# Altium schematic sheet 28pins_Antariksh_unoR3_V1I1_Schematic.SchDoc (part 3 of 5)
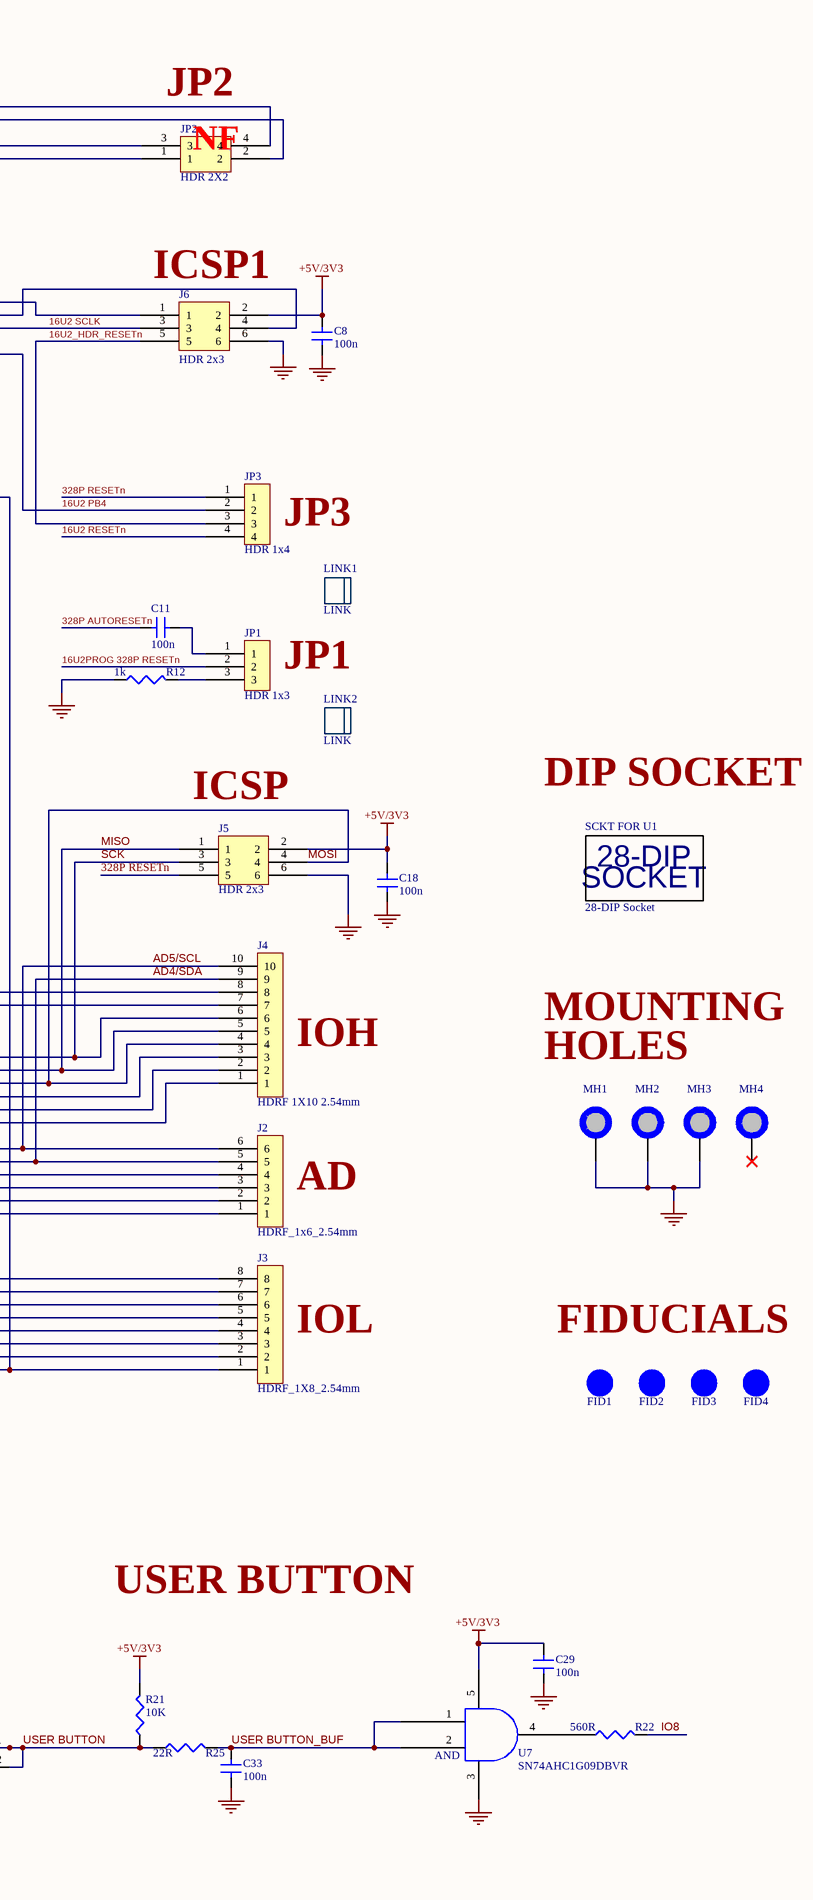
[diagram p3: 28pins_Antariksh_unoR3_V1I1_Schematic.SchDoc, right]

## Library data of the parts (continued)
J5 J6 = 67997-106HLF: Conn; Rect; Header; Unshrouded; 6 Pos; 2.54mm Pitch; 2-Row; Thru-Hole; BergStik; Manufacturer: Amphenol Communications Solutions; Connector Type: Male Pin; Current Rating: 5A; Dielectric Material: Polyethylene; Gender: Male; Insulation Resistance: 5GΩ; Lead Length: 3.05mm; Mating Post Length: 5.84mm; Max Voltage Rating (AC): 1.5kV; Number of Contacts: 6; Supplier 1: RS (Formerly Allied Electronics); Manufacturer Part Number: 67997-106HLF; RoHS: Compliant; Category: Headers and Wire Housings; Stock 1: 800; Pricing 1: 1=0.194 (USD); China RoHS: Compliant; Color: Black; Contact Gender: Male; Contact Material: Bronze; Contact Mating Length: 5.842mm; Contact Plating: Gold; Depth: 4.83mm; Flammability Rating: UL94 V-0; Housing Color: Black; Housing Material: Thermoplastic; Lead Free: Lead Free; Lead Pitch: 2.54mm; Length: 7.62mm; Lifecycle Status: Production; Max Operating Temperature: 130°C; Min Operating Temperature: -65°C; Mount: Through Hole; Number of Pins: 6; Number of Positions: 6; Number of Rows: 2; Orientation: Straight; Pitch: 2.54mm; Radiation Hardening: No; REACH SVHC: Yes; Row Spacing: 2.54mm; Schedule B: 8535908040, 8535908040|8535908040|8535908040|8535908040|8535908040|8535908040|8535908040|8535908040|8535908040|8535908040|8535908040|8535908040|8535908040|8535908040|8535908040|8535908040|8535908040|8535908040|8535908040|8535908040|8535908040|8535908040|8535908040|85; Terminal Pitch: 2.54mm; Termination: Through Hole; Voltage Rating: 1.5kV; ComponentLink1URL: https://datasheet.octopart.com:443/67997-106HLF-Amphenol-Communications-Solutions-datasheet-10288749.pdf?src-supplier=Newark; ComponentLink1Description: https://datasheet.octopart.com:443/67997-106HLF-Amphenol-Communications-Solutions-datasheet-10288749.pdf?src-supplier=Newark; ComponentLink2URL: https://datasheet.octopart.com:443/67997-106HLF-Areva-datasheet-10052131.pdf?src-supplier=Newark; ComponentLink2Description: https://datasheet.octopart.com:443/67997-106HLF-Areva-datasheet-10052131.pdf?src-supplier=Newark; ComponentLink3URL: https://datasheet.octopart.com:443/67997-106HLF-Areva-datasheet-8877144.pdf?src-supplier=Newark; ComponentLink3Description: https://datasheet.octopart.com:443/67997-106HLF-Areva-datasheet-8877144.pdf?src-supplier=Newark; ComponentLink4URL: https://datasheet.octopart.com:443/67997-106HLF-Areva-datasheet-8731571.pdf?src-supplier=Newark; ComponentLink4Description: https://datasheet.octopart.com:443/67997-106HLF-Areva-datasheet-8731571.pdf?src-supplier=Newark; ComponentLink5URL: https://datasheet.octopart.com:443/67997-106HLF-Areva-datasheet-8486089.pdf?src-supplier=Newark; ComponentLink5Description: https://datasheet.octopart.com:443/67997-106HLF-Areva-datasheet-8486089.pdf?src-supplier=Newark; ComponentLink6URL: https://datasheet.octopart.com:443/67997-106HLF-Amphenol-Communications-Solutions-datasheet-36854132.pdf?src-supplier=Farnell; ComponentLink6Description: https://datasheet.octopart.com:443/67997-106HLF-Amphenol-Communications-Solutions-datasheet-36854132.pdf?src-supplier=Farnell; ComponentLink7URL: https://datasheet.octopart.com:443/67997-106HLF-Amphenol-Communications-Solutions-datasheet-20739478.pdf?src-supplier=RS+(Formerly+Allied+Electronics); ComponentLink7Description: https://datasheet.octopart.com:443/67997-106HLF-Amphenol-Communications-Solutions-datasheet-20739478.pdf?src-supplier=RS+(Formerly+Allied+Electronics); ComponentLink8URL: https://datasheet.octopart.com:443/67997-106HLF-Areva-datasheet-118652.pdf?src-supplier=DigiKey; ComponentLink8Description: https://datasheet.octopart.com:443/67997-106HLF-Areva-datasheet-118652.pdf?src-supplier=DigiKey; Supplier Part Number 1: 70302482
J7 = 10118193-0001LF: USB - micro B USB 2.0 Receptacle Connector 5 Position Surface Mount, Right Angle, Horizontal; Manufacturer: Amphenol Communications Solutions; Connector Type: Receptacle, USB; Contact Resistance: 30mΩ; Current Rating: 1.8A; Dielectric Material: Liquid Crystal Polymer; Insulation Resistance: 1GΩ; Max Voltage Rating (AC): 100V; Number of Contacts: 5; Number of Ports: 1; Operating Force: 35.1392N; Pitch: 650µm; Plating Thickness: 762nm; USB Standard: USB 2.0; Supplier 1: Avnet; Manufacturer Part Number: 10118193-0001LF; RoHS: Compliant; Category: USB Connectors; Stock 1: 52800; Pricing 1: 1200=0.21529, 2400=0.20365, 4800=0.19829, 7200=0.19321, 9600=0.18838 (USD); China RoHS: Compliant; Color: Black; Contact Gender: Female; Contact Material: Gold, Nickel; Contact Plating: Gold; Depth: 5.67mm; Features: Shielded; Flammability Rating: UL94 V-0; Height: 3mm; Housing Material: Polymer; Length: 7.86mm; Lifecycle Status: Production; Max Operating Temperature: 80°C; Min Operating Temperature: -55°C; Mount: Horizontal, Surface Mount; Number of Pins: 5; Number of Rows: 1; Number of Terminals: 5; Orientation: Right Angle; Radiation Hardening: No; REACH SVHC: Yes; Shell Material: Stainless Steel; Terminal Pitch: 660.4µm; Termination: Solder; Voltage Rating: 100V; ComponentLink1URL: https://datasheet.octopart.com:443/10118193-0001LF-Amphenol-Communications-Solutions-datasheet-182239125.pdf?src-supplier=IHS; ComponentLink1Description: https://datasheet.octopart.com:443/10118193-0001LF-Amphenol-Communications-Solutions-datasheet-182239125.pdf?src-supplier=IHS; ComponentLink2URL: https://datasheet.octopart.com:443/10118193-0001LF-Amphenol-Communications-Solutions-datasheet-55953155.pdf?src-supplier=TME; ComponentLink2Description: https://datasheet.octopart.com:443/10118193-0001LF-Amphenol-Communications-Solutions-datasheet-55953155.pdf?src-supplier=TME; ComponentLink3URL: https://datasheet.octopart.com:443/10118193-0001LF-Amphenol-ICC-datasheet-116246833.pdf?src-supplier=Upverter; ComponentLink3Description: https://datasheet.octopart.com:443/10118193-0001LF-Amphenol-ICC-datasheet-116246833.pdf?src-supplier=Upverter; ComponentLink4URL: https://datasheet.octopart.com:443/10118193-0001LF-FCI-datasheet-141913714.pdf?src-supplier=Upverter; ComponentLink4Description: https://datasheet.octopart.com:443/10118193-0001LF-FCI-datasheet-141913714.pdf?src-supplier=Upverter; ComponentLink5URL: https://datasheet.octopart.com:443/10118193-0001LF-Amphenol-Communications-Solutions-datasheet-96019471.pdf?src-supplier=element14+APAC; ComponentLink5Description: https://datasheet.octopart.com:443/10118193-0001LF-Amphenol-Communications-Solutions-datasheet-96019471.pdf?src-supplier=element14+APAC; ComponentLink6URL: https://datasheet.octopart.com:443/10118193-0001LF-Amphenol-Communications-Solutions-datasheet-11792339.pdf?src-supplier=Electro+Sonic; ComponentLink6Description: https://datasheet.octopart.com:443/10118193-0001LF-Amphenol-Communications-Solutions-datasheet-11792339.pdf?src-supplier=Electro+Sonic; ComponentLink7URL: https://datasheet.octopart.com:443/10118193-0001LF-Amphenol-Communications-Solutions-datasheet-13702206.pdf?src-supplier=RS+(Formerly+Allied+Electronics); ComponentLink7Description: https://datasheet.octopart.com:443/10118193-0001LF-Amphenol-Communications-Solutions-datasheet-13702206.pdf?src-supplier=RS+(Formerly+Allied+Electronics); Supplier Part Number 1: 10118193-0001LF
J8 J9 = PAD_WITH_HOLE_4x1.5mm: PAD WITH A HOLE 4x1.5mm
JP1 JP4 = 68000-103HLF: Conn Unshrouded Header HDR 3 POS 2.54mm Solder ST Top Entry Thru-Hole BergStik® Bulk; Manufacturer: Amphenol Communications Solutions; Connector Type: Male Pin; Current Rating: 3A; Dielectric Material: Polyethylene; Gender: Male; Insulation Resistance: 5GΩ; Lead Length: 2.41mm; Mating Post Length: 5.84mm; Max Voltage Rating (AC): 1.5kV; Number of Contacts: 3; Plating Thickness: 762nm; Voltage Rating: 1.05kV; Supplier 1: RS (Formerly Allied Electronics); Manufacturer Part Number: 68000-103HLF; RoHS: Compliant; Category: Headers and Wire Housings; Stock 1: 34; Pricing 1: 1=0.313, 100=0.266, 250=0.25, 500=0.238, 1000=0.225, 2500=0.21 (USD); China RoHS: Compliant; Color: Black; Contact Gender: Male; Contact Material: Gold; Contact Mating Length: 5.842mm; Contact Plating: Gold; Depth: 2.41mm; Flammability Rating: UL94 V-0; Height: 8.73mm; Housing Color: Black; Housing Material: Thermoplastic; Lead Pitch: 2.54mm; Length: 7.62mm; Lifecycle Status: Production; Max Operating Temperature: 125°C; Min Operating Temperature: -65°C; Mount: Through Hole; Number of Pins: 3; Number of Positions: 3; Number of Rows: 1; Orientation: Straight; Packaging: Bulk; Pitch: 2.54mm; Radiation Hardening: No; REACH SVHC: Yes; Terminal Pitch: 2.54mm; Termination: Solder; ComponentLink1URL: https://datasheet.octopart.com:443/68000-103HLF-Amphenol-ICC---FCI-datasheet-155511504.pdf?src-supplier=Upverter; ComponentLink1Description: https://datasheet.octopart.com:443/68000-103HLF-Amphenol-ICC---FCI-datasheet-155511504.pdf?src-supplier=Upverter; ComponentLink2URL: https://datasheet.octopart.com:443/68000-103HLF-Amphenol-Communications-Solutions-datasheet-10088795.pdf?src-supplier=Farnell; ComponentLink2Description: https://datasheet.octopart.com:443/68000-103HLF-Amphenol-Communications-Solutions-datasheet-10088795.pdf?src-supplier=Farnell; ComponentLink3URL: https://datasheet.octopart.com:443/68000-103HLF-Amphenol-Communications-Solutions-datasheet-41232361.pdf?src-supplier=Farnell; ComponentLink3Description: https://datasheet.octopart.com:443/68000-103HLF-Amphenol-Communications-Solutions-datasheet-41232361.pdf?src-supplier=Farnell; ComponentLink4URL: https://datasheet.octopart.com:443/68000-103HLF-Areva-datasheet-8861575.pdf?src-supplier=Newark; ComponentLink4Description: https://datasheet.octopart.com:443/68000-103HLF-Areva-datasheet-8861575.pdf?src-supplier=Newark; ComponentLink5URL: https://datasheet.octopart.com:443/68000-103HLF-Areva-datasheet-8713716.pdf?src-supplier=Newark; ComponentLink5Description: https://datasheet.octopart.com:443/68000-103HLF-Areva-datasheet-8713716.pdf?src-supplier=Newark; ComponentLink6URL: https://datasheet.octopart.com:443/68000-103HLF-Areva-datasheet-8449737.pdf?src-supplier=Newark; ComponentLink6Description: https://datasheet.octopart.com:443/68000-103HLF-Areva-datasheet-8449737.pdf?src-supplier=Newark; ComponentLink7URL: https://datasheet.octopart.com:443/68000-103HLF-Amphenol-Communications-Solutions-datasheet-154727322.pdf?src-supplier=Electro+Sonic; ComponentLink7Description: https://datasheet.octopart.com:443/68000-103HLF-Amphenol-Communications-Solutions-datasheet-154727322.pdf?src-supplier=Electro+Sonic; ComponentLink8URL: https://datasheet.octopart.com:443/68000-103HLF-Amphenol-Communications-Solutions-datasheet-100449246.pdf?src-supplier=TME; ComponentLink8Description: https://datasheet.octopart.com:443/68000-103HLF-Amphenol-Communications-Solutions-datasheet-100449246.pdf?src-supplier=TME; ComponentLink9URL: https://datasheet.octopart.com:443/68000-103HLF-Amphenol-datasheet-170317325.pdf?src-supplier=Amar+Radio+Corporation; ComponentLink9Description: https://datasheet.octopart.com:443/68000-103HLF-Amphenol-datasheet-170317325.pdf?src-supplier=Amar+Radio+Corporation; ComponentLink10URL: https://datasheet.octopart.com:443/68000-103HLF-Amphenol-Communications-Solutions-datasheet-13448982.pdf?src-supplier=RS+(Formerly+Allied+Electronics); ComponentLink10Description: https://datasheet.octopart.com:443/68000-103HLF-Amphenol-Communications-Solutions-datasheet-13448982.pdf?src-supplier=RS+(Formerly+Allied+Electronics); Supplier Part Number 1: 70236888
JP2 = 67996-104HLF: Conn Unshrouded Header HDR 4 POS 2.54mm Solder ST Top Entry Thru-Hole BergStik® Bulk; Manufacturer: Amphenol Communications Solutions; Connector Type: Male Pin; Current Rating: 3A; Gender: Male; Insulation Resistance: 5GΩ; Lead Length: 2.41mm; Mating Post Length: 5.84mm; Max Voltage Rating (AC): 1.5kV; Number of Contacts: 4; Supplier 1: Avnet; Manufacturer Part Number: 67996-104HLF; RoHS: Compliant; Category: Headers and Wire Housings; Stock 1: 5; Pricing 1: 1=0.282 (USD); China RoHS: Compliant; Color: Black; Contact Gender: Male; Contact Material: Bronze; Contact Mating Length: 5.842mm; Contact Plating: Gold; Depth: 4.83mm; Housing Color: Black; Housing Material: Thermoplastic; Lead Pitch: 2.54mm; Length: 5.08mm; Lifecycle Status: Production; Max Operating Temperature: 125°C; Min Operating Temperature: -65°C; Mount: Through Hole; Number of Pins: 4; Number of Positions: 4; Number of Rows: 2; Orientation: Straight; Packaging: Bulk; Pitch: 2.54mm; Radiation Hardening: No; REACH SVHC: Yes; Row Spacing: 2.54mm; Schedule B: 8535908040, 8535908040|8535908040, 8535908040|8535908040|8535908040, 8535908040|8535908040|8535908040|8535908040; Terminal Pitch: 2.54mm; Termination: Solder; Voltage Rating: 1.5kV; ComponentLink1URL: https://datasheet.octopart.com:443/67996-104HLF-Amphenol-Communications-Solutions-datasheet-36854132.pdf?src-supplier=Electro+Sonic; ComponentLink1Description: https://datasheet.octopart.com:443/67996-104HLF-Amphenol-Communications-Solutions-datasheet-36854132.pdf?src-supplier=Electro+Sonic; ComponentLink2URL: https://datasheet.octopart.com:443/67996-104HLF-Areva-datasheet-10288749.pdf?src-supplier=Farnell; ComponentLink2Description: https://datasheet.octopart.com:443/67996-104HLF-Areva-datasheet-10288749.pdf?src-supplier=Farnell; ComponentLink3URL: https://datasheet.octopart.com:443/67996-104HLF-Areva-datasheet-10052131.pdf?src-supplier=Farnell; ComponentLink3Description: https://datasheet.octopart.com:443/67996-104HLF-Areva-datasheet-10052131.pdf?src-supplier=Farnell; ComponentLink4URL: https://datasheet.octopart.com:443/67996-104HLF-Areva-datasheet-8877144.pdf?src-supplier=Farnell; ComponentLink4Description: https://datasheet.octopart.com:443/67996-104HLF-Areva-datasheet-8877144.pdf?src-supplier=Farnell; ComponentLink5URL: https://datasheet.octopart.com:443/67996-104HLF-Areva-datasheet-8731571.pdf?src-supplier=Farnell; ComponentLink5Description: https://datasheet.octopart.com:443/67996-104HLF-Areva-datasheet-8731571.pdf?src-supplier=Farnell; ComponentLink6URL: https://datasheet.octopart.com:443/67996-104HLF-Areva-datasheet-8486089.pdf?src-supplier=Farnell; ComponentLink6Description: https://datasheet.octopart.com:443/67996-104HLF-Areva-datasheet-8486089.pdf?src-supplier=Farnell; ComponentLink7URL: https://datasheet.octopart.com:443/67996-104HLF-Amphenol-Communications-Solutions-datasheet-13455363.pdf?src-supplier=RS+(Formerly+Allied+Electronics); ComponentLink7Description: https://datasheet.octopart.com:443/67996-104HLF-Amphenol-Communications-Solutions-datasheet-13455363.pdf?src-supplier=RS+(Formerly+Allied+Electronics); Supplier Part Number 1: 20M2185
JP3 = 68001-204HLF: Conn Unshrouded Header HDR 4 POS 2.54mm Solder ST Top Entry Thru-Hole BergStik® Bulk; Manufacturer: Amphenol Communications Solutions; Connector Type: Male Pin; Current Rating: 3A; Gender: Male; Insulation Resistance: 5GΩ; Lead Length: 3.05mm; Mating Post Length: 5.84mm; Number of Contacts: 4; Voltage Rating: 1.5kV; Supplier 1: Avnet; Manufacturer Part Number: 68001-204HLF; RoHS: Compliant; Category: Headers and Wire Housings; Stock 1: 10500; Pricing 1: 1000=0.08941 (USD); China RoHS: Compliant; Color: Black; Contact Gender: Male; Contact Material: Bronze; Contact Mating Length: 5.842mm; Contact Plating: GXT, Gold; Flammability Rating: UL94 V-0; Housing Material: Thermoplastic; Lead Pitch: 2.54mm; Lifecycle Status: Production; Max Operating Temperature: 130°C; Min Operating Temperature: -65°C; Mount: Through Hole; Number of Pins: 4; Number of Positions: 4; Number of Rows: 1; Orientation: Straight; Packaging: Bulk; Pitch: 2.54mm; Radiation Hardening: No; REACH SVHC: Yes; Schedule B: 8535908040; Terminal Pitch: 2.54mm; Termination: Solder; ComponentLink1URL: https://datasheet.octopart.com:443/68001-204HLF-Amphenol-Communications-Solutions-datasheet-151206381.pdf?src-supplier=IHS; ComponentLink1Description: https://datasheet.octopart.com:443/68001-204HLF-Amphenol-Communications-Solutions-datasheet-151206381.pdf?src-supplier=IHS; ComponentLink2URL: https://datasheet.octopart.com:443/68001-204HLF-Amphenol-Communications-Solutions-datasheet-154727322.pdf?src-supplier=Master+Electronics; ComponentLink2Description: https://datasheet.octopart.com:443/68001-204HLF-Amphenol-Communications-Solutions-datasheet-154727322.pdf?src-supplier=Master+Electronics; ComponentLink3URL: https://datasheet.octopart.com:443/68001-204HLF-Amphenol-Communications-Solutions-datasheet-41232361.pdf?src-supplier=element14+APAC; ComponentLink3Description: https://datasheet.octopart.com:443/68001-204HLF-Amphenol-Communications-Solutions-datasheet-41232361.pdf?src-supplier=element14+APAC; ComponentLink4URL: https://datasheet.octopart.com:443/68001-204HLF-Amphenol-Communications-Solutions-datasheet-100449246.pdf?src-supplier=Future+Electronics; ComponentLink4Description: https://datasheet.octopart.com:443/68001-204HLF-Amphenol-Communications-Solutions-datasheet-100449246.pdf?src-supplier=Future+Electronics; ComponentLink5URL: https://datasheet.octopart.com:443/68001-204HLF-Amphenol-Communications-Solutions-datasheet-20739502.pdf?src-supplier=RS+(Formerly+Allied+Electronics); ComponentLink5Description: https://datasheet.octopart.com:443/68001-204HLF-Amphenol-Communications-Solutions-datasheet-20739502.pdf?src-supplier=RS+(Formerly+Allied+Electronics); Supplier Part Number 1: 68001-204HLF
L1 = L1210R2R2MDWIT: General Purpose Inductor, 2.2uH, 20%, 1 Element, Ferrite-Core, SMD, 1210; Manufacturer: KEMET; DC Current: 1.13A; DC Resistance (DCR): 80mΩ; Inductance: 2.2µH; Number of Circuits: 1; Self Resonant Frequency: 190MHz; Shielding: No; Test Frequency: 100kHz; Supplier 1: Farnell; Manufacturer Part Number: L1210R2R2MDWIT; RoHS: Compliant; Category: Fixed Inductors; Pricing 1: 10=0.271, 100=0.204, 500=0.189, 1000=0.173, 2000=0.17 (GBP); Case/Package: 1210; Case Code (Imperial): 1210; Case Code (Metric): 3225; Composition: Ceramic, Wirewound; Core Material: Ferrite; Current Rating: 2A; Depth: 2.7mm; Height: 2.5mm; Height - Seated (Max): 2.6924mm; Inductance Tolerance: 20%; Length: 3.2004mm; Lifecycle Status: Obsolete; Max Current Rating: 1.13A; Max DC Current: 2A; Max Operating Temperature: 105°C; Military Standard: Not; Min Operating Temperature: -25°C; Mount: Surface Mount; Number of Terminals: 2; Packaging: Cut Tape; Radiation Hardening: No; REACH SVHC: Yes; Resistance: 80mΩ; Schedule B: 8504500000, 8504500000|8504500000, 8504500000|8504500000|8504500000, 8504500000|8504500000|8504500000|8504500000; Termination: SMD/SMT; Tolerance: 20%; Width: 2.5mm; ComponentLink1URL: https://datasheet.octopart.com:443/L1210R2R2MDWIT-KEMET-datasheet-179859846.pdf?src-supplier=Farnell; ComponentLink1Description: https://datasheet.octopart.com:443/L1210R2R2MDWIT-KEMET-datasheet-179859846.pdf?src-supplier=Farnell; ComponentLink2URL: https://datasheet.octopart.com:443/L1210R2R2MDWIT-Kemet-datasheet-13696102.pdf?src-supplier=Farnell; ComponentLink2Description: https://datasheet.octopart.com:443/L1210R2R2MDWIT-Kemet-datasheet-13696102.pdf?src-supplier=Farnell; ComponentLink3URL: https://datasheet.octopart.com:443/L1210R2R2MDWIT-KEMET-datasheet-170164675.pdf?src-supplier=Newark; ComponentLink3Description: https://datasheet.octopart.com:443/L1210R2R2MDWIT-KEMET-datasheet-170164675.pdf?src-supplier=Newark; ComponentLink4URL: https://datasheet.octopart.com:443/L1210R2R2MDWIT-Kemet-datasheet-153804.pdf?src-supplier=element14+APAC; ComponentLink4Description: https://datasheet.octopart.com:443/L1210R2R2MDWIT-Kemet-datasheet-153804.pdf?src-supplier=element14+APAC; ComponentLink5URL: https://datasheet.octopart.com:443/L1210R2R2MDWIT-KEMET-datasheet-86778059.pdf?src-supplier=element14+APAC; ComponentLink5Description: https://datasheet.octopart.com:443/L1210R2R2MDWIT-KEMET-datasheet-86778059.pdf?src-supplier=element14+APAC; ComponentLink6URL: https://datasheet.octopart.com:443/L1210R2R2MDWIT-KEMET-datasheet-147336235.pdf?src-supplier=Ciiva; ComponentLink6Description: https://datasheet.octopart.com:443/L1210R2R2MDWIT-KEMET-datasheet-147336235.pdf?src-supplier=Ciiva; Supplier Part Number 1: 3638976
LINK1-LINK3 = QPC02SXGN-RC: 2 Position 2.54 mm Centerline Single Circuit Open Top Jumper; Manufacturer: Sullins; Current Rating: 3A; Number of Contacts: 2; Pitch: 2.54mm; Supplier 1: DigiKey; Manufacturer Part Number: QPC02SXGN-RC; RoHS: Compliant; Category: Connectors; Stock 1: 1304739; Pricing 1: 1=0.1, 10=0.025, 25=0.0236, 50=0.0224, 100=0.0213, 250=0.02, 500=0.01904, 2000=0.01726, 4000=0.01644 (USD); Case/Package: 100; Contact Gender: Female; Contact Material: Brass; Contact Plating: Gold; Height: 6.17mm; Lead Free: Lead Free; Lifecycle Status: Production; Max Operating Temperature: 85°C; Min Operating Temperature: -40°C; Number of Pins: 1; Number of Positions: 2; Packaging: Bulk; REACH SVHC: Yes; ComponentLink1URL: https://datasheet.octopart.com:443/QPC02SXGN-RC-Sullins-datasheet-138898435.pdf?src-supplier=ODG+(Origin+Data+Global); ComponentLink1Description: https://datasheet.octopart.com:443/QPC02SXGN-RC-Sullins-datasheet-138898435.pdf?src-supplier=ODG+(Origin+Data+Global); ComponentLink2URL: https://datasheet.octopart.com:443/QPC02SXGN-RC-Sullins-datasheet-12521006.pdf?src-supplier=IHS; ComponentLink2Description: https://datasheet.octopart.com:443/QPC02SXGN-RC-Sullins-datasheet-12521006.pdf?src-supplier=IHS; ComponentLink3URL: https://sigma.octopart.com:443/138898456/technical_drawing/Sullins-QPC02SXGN-RC.pdf?src-supplier=Upverter; ComponentLink3Description: https://sigma.octopart.com:443/138898456/technical_drawing/Sullins-QPC02SXGN-RC.pdf?src-supplier=Upverter; ComponentLink4URL: https://datasheet.octopart.com:443/QPC02SXGN-RC-Sullins-datasheet-41399305.pdf?src-supplier=Future+Electronics; ComponentLink4Description: https://datasheet.octopart.com:443/QPC02SXGN-RC-Sullins-datasheet-41399305.pdf?src-supplier=Future+Electronics; Supplier Part Number 1: S9337-ND
MH1-MH3 = MH_7.4mmCx2.3mmD: Mounting Hole 7.4mm Diameter, 3.2mm Drill
MH4 = MH_7.4mmNCx2.3mmD: Mounting Hole 7.4mm Diameter (Non-Copper), 3.2mm Drill (Non-Plated)
R1 = RC0805FR-07100KL: 125mW Thick Film Resistors 150V ±100ppm/℃ ±1% 100kΩ 0805 Chip Resistor - Surface Mount ROHS; Manufacturer: Yageo Group; Temperature Coefficient: 100ppm/°C; Supplier 1: Newark; Manufacturer Part Number: RC0805FR-07100KL; RoHS: Compliant; Category: Chip SMD Resistors; Stock 1: 308435; Pricing 1: 10=0.016, 25=0.015, 50=0.014, 100=0.013, 250=0.012, 500=0.012, 1000=0.011 (USD); Case/Package: 0805; Case Code (Imperial): 0805; China RoHS: Non-Compliant; Composition: Thick Film; Depth: 1.25mm; Features: Moisture Resistant; Height: 500µm; Lead Free: Lead Free; Lead Pitch: 400µm; Length: 2mm; Lifecycle Status: Production; Max Operating Temperature: 155°C; Max Power Dissipation: 125mW; Military Standard: Not; Min Operating Temperature: -55°C; Mount: Surface Mount; Number of Pins: 2; Number of Terminals: 2; Number of Terminations: 2; Packaging: Tape & Reel; Power Dissipation: 125mW; Power Rating: 125mW; REACH SVHC: Yes; Resistance: 100kΩ; Schedule B: 8533210045, 8533210045|8533210045, 8533210045|8533210045|8533210045, 8533210045|8533210045|8533210045|8533210045; Termination: SMD/SMT; Tolerance: 1%; Voltage Rating: 150V; Voltage Rating (AC): 150V; Voltage Rating (DC): 150V; Width: 1.25mm; Working Voltage: 150V; ComponentLink1URL: https://datasheet.octopart.com:443/RC0805FR-07100KL-Yageo-datasheet-175887523.pdf?src-supplier=IHS; ComponentLink1Description: https://datasheet.octopart.com:443/RC0805FR-07100KL-Yageo-datasheet-175887523.pdf?src-supplier=IHS; ComponentLink2URL: https://datasheet.octopart.com:443/RC0805FR-07100KL-Yageo-datasheet-164759695.pdf?src-supplier=Upverter; ComponentLink2Description: https://datasheet.octopart.com:443/RC0805FR-07100KL-Yageo-datasheet-164759695.pdf?src-supplier=Upverter; ComponentLink3URL: https://datasheet.octopart.com:443/RC0805FR-07100KL-Yageo-datasheet-103092701.pdf?src-supplier=Upverter; ComponentLink3Description: https://datasheet.octopart.com:443/RC0805FR-07100KL-Yageo-datasheet-103092701.pdf?src-supplier=Upverter; ComponentLink4URL: https://sigma.octopart.com:443/138820526/technical_drawing/Yageo-RC0805FR-07100KL.pdf?src-supplier=Upverter; ComponentLink4Description: https://sigma.octopart.com:443/138820526/technical_drawing/Yageo-RC0805FR-07100KL.pdf?src-supplier=Upverter; ComponentLink5URL: https://datasheet.octopart.com:443/RC0805FR-07100KL-Yageo-datasheet-118657.pdf?src-supplier=DigiKey; ComponentLink5Description: https://datasheet.octopart.com:443/RC0805FR-07100KL-Yageo-datasheet-118657.pdf?src-supplier=DigiKey; ComponentLink6URL: https://datasheet.octopart.com:443/RC0805FR-07100KL-Yageo-datasheet-8330313.pdf?src-supplier=element14+APAC; ComponentLink6Description: https://datasheet.octopart.com:443/RC0805FR-07100KL-Yageo-datasheet-8330313.pdf?src-supplier=element14+APAC; ComponentLink7URL: https://datasheet.octopart.com:443/RC0805FR-07100KL-Yageo-datasheet-12592811.pdf?src-supplier=element14+APAC; ComponentLink7Description: https://datasheet.octopart.com:443/RC0805FR-07100KL-Yageo-datasheet-12592811.pdf?src-supplier=element14+APAC; ComponentLink8URL: https://datasheet.octopart.com:443/RC0805FR-07100KL-Yageo-datasheet-62067350.pdf?src-supplier=Farnell; ComponentLink8Description: https://datasheet.octopart.com:443/RC0805FR-07100KL-Yageo-datasheet-62067350.pdf?src-supplier=Farnell; ComponentLink9URL: https://datasheet.octopart.com:443/RC0805FR-07100KL-Yageo-datasheet-13691069.pdf?src-supplier=Farnell; ComponentLink9Description: https://datasheet.octopart.com:443/RC0805FR-07100KL-Yageo-datasheet-13691069.pdf?src-supplier=Farnell; ComponentLink10URL: https://datasheet.octopart.com:443/RC0805FR-07100KL-Yageo-datasheet-127823281.pdf?src-supplier=Future+Electronics; ComponentLink10Description: https://datasheet.octopart.com:443/RC0805FR-07100KL-Yageo-datasheet-127823281.pdf?src-supplier=Future+Electronics; ComponentLink11URL: https://datasheet.octopart.com:443/RC0805FR-07100KL-Yageo-datasheet-137700087.pdf?src-supplier=Future+Electronics; ComponentLink11Description: https://datasheet.octopart.com:443/RC0805FR-07100KL-Yageo-datasheet-137700087.pdf?src-supplier=Future+Electronics; ComponentLink12URL: https://datasheet.octopart.com:443/RC0805FR-07100KL-Yageo-datasheet-77992522.pdf?src-supplier=Future+Electronics; ComponentLink12Description: https://datasheet.octopart.com:443/RC0805FR-07100KL-Yageo-datasheet-77992522.pdf?src-supplier=Future+Electronics; ComponentLink13URL: https://datasheet.octopart.com:443/RC0805FR-07100KL-Yageo-datasheet-80324437.pdf?src-supplier=Future+Electronics; ComponentLink13Description: https://datasheet.octopart.com:443/RC0805FR-07100KL-Yageo-datasheet-80324437.pdf?src-supplier=Future+Electronics; ComponentLink14URL: https://datasheet.octopart.com:443/RC0805FR-07100KL-Yageo-datasheet-67302840.pdf?src-supplier=Future+Electronics; ComponentLink14Description: https://datasheet.octopart.com:443/RC0805FR-07100KL-Yageo-datasheet-67302840.pdf?src-supplier=Future+Electronics; ComponentLink15URL: https://datasheet.octopart.com:443/RC0805FR-07100KL-Yageo-datasheet-8324252.pdf?src-supplier=Future+Electronics; ComponentLink15Description: https://datasheet.octopart.com:443/RC0805FR-07100KL-Yageo-datasheet-8324252.pdf?src-supplier=Future+Electronics; ComponentLink16URL: https://datasheet.octopart.com:443/RC0805FR-07100KL-Yageo-datasheet-79472498.pdf?src-supplier=Megastar; ComponentLink16Description: https://datasheet.octopart.com:443/RC0805FR-07100KL-Yageo-datasheet-79472498.pdf?src-supplier=Megastar; ComponentLink17URL: https://datasheet.octopart.com:443/RC0805FR-07100KL-Yageo-datasheet-27714392.pdf?src-supplier=Seeed+Studio; ComponentLink17Description: https://datasheet.octopart.com:443/RC0805FR-07100KL-Yageo-datasheet-27714392.pdf?src-supplier=Seeed+Studio; ComponentLink18URL: https://datasheet.octopart.com/RC0805FR-07100KL-Yageo-datasheet-73766026.pdf; ComponentLink18Description: https://datasheet.octopart.com/RC0805FR-07100KL-Yageo-datasheet-73766026.pdf; ComponentLink19URL: https://datasheet.octopart.com:443/RC0805FR-07100KL-Yageo-datasheet-502840.pdf?src-supplier=element14; ComponentLink19Description: https://datasheet.octopart.com:443/RC0805FR-07100KL-Yageo-datasheet-502840.pdf?src-supplier=element14; ComponentLink20URL: http://sigma.octopart.com:80/rohs_statement/Yageo-company-2.pdf?src-supplier=Compliance+Statements; ComponentLink20Description: http://sigma.octopart.com:80/rohs_statement/Yageo-company-2.pdf?src-supplier=Compliance+Statements; ComponentLink21URL: http://sigma.octopart.com:80/conflict_mineral_statement/Yageo-company-3.pdf?src-supplier=Compliance+Statements; ComponentLink21Description: http://sigma.octopart.com:80/conflict_mineral_statement/Yageo-company-3.pdf?src-supplier=Compliance+Statements; Supplier Part Number 1: 05M4536
R2 R3 R15 R17 R22 = RC0805FR-07560RL: Res Thick Film 0805 560 Ohm 1% 0.125W(1/8W) ±100ppm/C Pad SMD T/R; Manufacturer: Yageo Group; Max Power Dissipation: 125mW; Resistance: 560Ω; Temperature Coefficient: 100ppm/°C; Voltage Rating: 150V; Supplier 1: Avnet; Manufacturer Part Number: RC0805FR-07560RL; RoHS: Compliant; Category: Chip SMD Resistors; Stock 1: 3094; Pricing 1: 1=0.104, 25=0.015, 50=0.012, 100=0.009 (USD); Case/Package: 0805; Case Code (Imperial): 0805; China RoHS: Non-Compliant; Composition: Thick Film; Depth: 1.25mm; Features: Moisture Resistant; Height: 500µm; Lead Free: Lead Free; Length: 2mm; Lifecycle Status: Production; Max Operating Temperature: 155°C; Military Standard: Not; Min Operating Temperature: -55°C; Mount: Surface Mount; Number of Pins: 2; Number of Terminals: 2; Number of Terminations: 2; Packaging: Tape & Reel; Power Dissipation: 125mW; Power Rating: 125mW; REACH SVHC: Yes; Schedule B: 8533210045, 8533210045|8533210045, 8533210045|8533210045|8533210045, 8533210045|8533210045|8533210045|8533210045; Termination: SMD/SMT; Tolerance: 1%; Voltage Rating (AC): 150V; Voltage Rating (DC): 150V; Weight: 5.499807mg; Width: 1.25mm; Working Voltage: 150V; ComponentLink1URL: https://datasheet.octopart.com:443/RC0805FR-07560RL-Yageo-datasheet-175887523.pdf?src-supplier=Newark; ComponentLink1Description: https://datasheet.octopart.com:443/RC0805FR-07560RL-Yageo-datasheet-175887523.pdf?src-supplier=Newark; ComponentLink2URL: https://datasheet.octopart.com:443/RC0805FR-07560RL-Yageo-datasheet-8328172.pdf?src-supplier=Newark; ComponentLink2Description: https://datasheet.octopart.com:443/RC0805FR-07560RL-Yageo-datasheet-8328172.pdf?src-supplier=Newark; ComponentLink3URL: https://datasheet.octopart.com:443/RC0805FR-07560RL-Yageo-datasheet-103092701.pdf?src-supplier=Upverter; ComponentLink3Description: https://datasheet.octopart.com:443/RC0805FR-07560RL-Yageo-datasheet-103092701.pdf?src-supplier=Upverter; ComponentLink4URL: https://datasheet.octopart.com:443/RC0805FR-07560RL-Yageo-datasheet-8330313.pdf?src-supplier=element14+APAC; ComponentLink4Description: https://datasheet.octopart.com:443/RC0805FR-07560RL-Yageo-datasheet-8330313.pdf?src-supplier=element14+APAC; ComponentLink5URL: https://datasheet.octopart.com:443/RC0805FR-07560RL-Yageo-datasheet-62067350.pdf?src-supplier=element14+APAC; ComponentLink5Description: https://datasheet.octopart.com:443/RC0805FR-07560RL-Yageo-datasheet-62067350.pdf?src-supplier=element14+APAC; ComponentLink6URL: https://datasheet.octopart.com:443/RC0805FR-07560RL-Yageo-datasheet-164759695.pdf?src-supplier=Future+Electronics; ComponentLink6Description: https://datasheet.octopart.com:443/RC0805FR-07560RL-Yageo-datasheet-164759695.pdf?src-supplier=Future+Electronics; ComponentLink7URL: https://datasheet.octopart.com:443/RC0805FR-07560RL-Yageo-datasheet-12592811.pdf?src-supplier=Future+Electronics; ComponentLink7Description: https://datasheet.octopart.com:443/RC0805FR-07560RL-Yageo-datasheet-12592811.pdf?src-supplier=Future+Electronics; ComponentLink8URL: https://datasheet.octopart.com:443/RC0805FR-07560RL-Yageo-datasheet-8324252.pdf?src-supplier=Future+Electronics; ComponentLink8Description: https://datasheet.octopart.com:443/RC0805FR-07560RL-Yageo-datasheet-8324252.pdf?src-supplier=Future+Electronics; ComponentLink9URL: https://datasheet.octopart.com:443/RC0805FR-07560RL-Yageo-datasheet-79472498.pdf?src-supplier=Megastar; ComponentLink9Description: https://datasheet.octopart.com:443/RC0805FR-07560RL-Yageo-datasheet-79472498.pdf?src-supplier=Megastar; ComponentLink10URL: https://datasheet.octopart.com/RC0805FR-07560RL-Yageo-datasheet-73766026.pdf; ComponentLink10Description: https://datasheet.octopart.com/RC0805FR-07560RL-Yageo-datasheet-73766026.pdf; ComponentLink11URL: https://datasheet.octopart.com:443/RC0805FR-07560RL-Yageo-datasheet-118657.pdf?src-supplier=DigiKey; ComponentLink11Description: https://datasheet.octopart.com:443/RC0805FR-07560RL-Yageo-datasheet-118657.pdf?src-supplier=DigiKey; ComponentLink12URL: http://sigma.octopart.com:80/conflict_mineral_statement/Yageo-company-3.pdf?src-supplier=Compliance+Statements; ComponentLink12Description: http://sigma.octopart.com:80/conflict_mineral_statement/Yageo-company-3.pdf?src-supplier=Compliance+Statements; ComponentLink13URL: http://sigma.octopart.com:80/rohs_statement/Yageo-company-2.pdf?src-supplier=Compliance+Statements; ComponentLink13Description: http://sigma.octopart.com:80/rohs_statement/Yageo-company-2.pdf?src-supplier=Compliance+Statements; Supplier Part Number 1: 49AK3322
R4 R14 R18-R21 = RC0805FR-0710KL: Res Thick Film 0805 10K Ohm 1% 0.125W(1/8W) +/-100ppm/C Epoxy Pad SMD T/R; Manufacturer: Yageo Group; Max Power Dissipation: 125mW; Resistance: 10kΩ; Temperature Coefficient: 100ppm/°C; Voltage Rating: 150V; Supplier 1: Avnet; Manufacturer Part Number: RC0805FR-0710KL; RoHS: Compliant; Category: Chip SMD Resistors; Stock 1: 150000; Pricing 1: 5000=0.00231, 10000=0.00225, 20000=0.0022, 30000=0.00216, 40000=0.0021 (USD); Case/Package: 0805; Case Code (Imperial): 0805; China RoHS: Non-Compliant; Composition: Thick Film; Depth: 1.25mm; Features: Moisture Resistant; Height: 500µm; Lead Free: Lead Free; Length: 2mm; Lifecycle Status: Production; Max Operating Temperature: 155°C; Military Standard: Not; Min Operating Temperature: -55°C; Mount: Surface Mount; Number of Pins: 2; Number of Terminals: 2; Number of Terminations: 2; Packaging: Tape and Reel; Power Dissipation: 125mW; Power Rating: 125mW; REACH SVHC: Yes; Schedule B: 8533210045, 8533210045|8533210045|8533210045|8533210045|8533210045|8533210045|8533210045|8533210045|8533210045|8533210045|8533210045|8533210045|8533210045|8533210045|8533210045|8533210045|8533210045|8533210045|8533210045|8533210045|8533210045|8533210045|8533210045|85; Termination: SMD/SMT; Tolerance: 1%; Voltage Rating (AC): 150V; Width: 1.25mm; Working Voltage: 150V; ComponentLink1URL: https://datasheet.octopart.com:443/RC0805FR-0710KL-Yageo-datasheet-175887523.pdf?src-supplier=IHS; ComponentLink1Description: https://datasheet.octopart.com:443/RC0805FR-0710KL-Yageo-datasheet-175887523.pdf?src-supplier=IHS; ComponentLink2URL: https://datasheet.octopart.com:443/RC0805FR-0710KL-Yageo-datasheet-62067350.pdf?src-supplier=Farnell; ComponentLink2Description: https://datasheet.octopart.com:443/RC0805FR-0710KL-Yageo-datasheet-62067350.pdf?src-supplier=Farnell; ComponentLink3URL: https://datasheet.octopart.com:443/RC0805FR-0710KL-Yageo-datasheet-13691069.pdf?src-supplier=Farnell; ComponentLink3Description: https://datasheet.octopart.com:443/RC0805FR-0710KL-Yageo-datasheet-13691069.pdf?src-supplier=Farnell; ComponentLink4URL: https://datasheet.octopart.com:443/RC0805FR-0710KL-Yageo-datasheet-103092701.pdf?src-supplier=Upverter; ComponentLink4Description: https://datasheet.octopart.com:443/RC0805FR-0710KL-Yageo-datasheet-103092701.pdf?src-supplier=Upverter; ComponentLink5URL: https://datasheet.octopart.com:443/RC0805FR-0710KL-Yageo-datasheet-98239111.pdf?src-supplier=Upverter; ComponentLink5Description: https://datasheet.octopart.com:443/RC0805FR-0710KL-Yageo-datasheet-98239111.pdf?src-supplier=Upverter; ComponentLink6URL: https://datasheet.octopart.com:443/RC0805FR-0710KL-Yageo---Phycomp-datasheet-67302840.pdf?src-supplier=Upverter; ComponentLink6Description: https://datasheet.octopart.com:443/RC0805FR-0710KL-Yageo---Phycomp-datasheet-67302840.pdf?src-supplier=Upverter; ComponentLink7URL: https://datasheet.octopart.com:443/RC0805FR-0710KL-Yageo-datasheet-8330313.pdf?src-supplier=element14+APAC; ComponentLink7Description: https://datasheet.octopart.com:443/RC0805FR-0710KL-Yageo-datasheet-8330313.pdf?src-supplier=element14+APAC; ComponentLink8URL: https://datasheet.octopart.com:443/RC0805FR-0710KL-Yageo-datasheet-12592811.pdf?src-supplier=element14+APAC; ComponentLink8Description: https://datasheet.octopart.com:443/RC0805FR-0710KL-Yageo-datasheet-12592811.pdf?src-supplier=element14+APAC; ComponentLink9URL: https://datasheet.octopart.com:443/RC0805FR-0710KL-Yageo-datasheet-164759695.pdf?src-supplier=Future+Electronics; ComponentLink9Description: https://datasheet.octopart.com:443/RC0805FR-0710KL-Yageo-datasheet-164759695.pdf?src-supplier=Future+Electronics; ComponentLink10URL: https://datasheet.octopart.com:443/RC0805FR-0710KL-Yageo-datasheet-15800360.pdf?src-supplier=Future+Electronics; ComponentLink10Description: https://datasheet.octopart.com:443/RC0805FR-0710KL-Yageo-datasheet-15800360.pdf?src-supplier=Future+Electronics; ComponentLink11URL: https://datasheet.octopart.com:443/RC0805FR-0710KL-Yageo-datasheet-8324252.pdf?src-supplier=Future+Electronics; ComponentLink11Description: https://datasheet.octopart.com:443/RC0805FR-0710KL-Yageo-datasheet-8324252.pdf?src-supplier=Future+Electronics; ComponentLink12URL: https://datasheet.octopart.com:443/RC0805FR-0710KL-Yageo-datasheet-79472498.pdf?src-supplier=Megastar; ComponentLink12Description: https://datasheet.octopart.com:443/RC0805FR-0710KL-Yageo-datasheet-79472498.pdf?src-supplier=Megastar; ComponentLink13URL: https://datasheet.octopart.com:443/RC0805FR-0710KL-Yageo-datasheet-27714392.pdf?src-supplier=Seeed+Studio; ComponentLink13Description: https://datasheet.octopart.com:443/RC0805FR-0710KL-Yageo-datasheet-27714392.pdf?src-supplier=Seeed+Studio; ComponentLink14URL: https://datasheet.octopart.com/RC0805FR-0710KL-Yageo-datasheet-73766026.pdf; ComponentLink14Description: https://datasheet.octopart.com/RC0805FR-0710KL-Yageo-datasheet-73766026.pdf; ComponentLink15URL: https://datasheet.octopart.com:443/RC0805FR-0710KL-Yageo-datasheet-118657.pdf?src-supplier=DigiKey; ComponentLink15Description: https://datasheet.octopart.com:443/RC0805FR-0710KL-Yageo-datasheet-118657.pdf?src-supplier=DigiKey; ComponentLink16URL: https://datasheet.octopart.com:443/RC0805FR-0710KL-Yageo-datasheet-502840.pdf?src-supplier=element14; ComponentLink16Description: https://datasheet.octopart.com:443/RC0805FR-0710KL-Yageo-datasheet-502840.pdf?src-supplier=element14; ComponentLink17URL: http://sigma.octopart.com:80/conflict_mineral_statement/Yageo-company-3.pdf?src-supplier=Compliance+Statements; ComponentLink17Description: http://sigma.octopart.com:80/conflict_mineral_statement/Yageo-company-3.pdf?src-supplier=Compliance+Statements; ComponentLink18URL: http://sigma.octopart.com:80/rohs_statement/Yageo-company-2.pdf?src-supplier=Compliance+Statements; ComponentLink18Description: http://sigma.octopart.com:80/rohs_statement/Yageo-company-2.pdf?src-supplier=Compliance+Statements; Supplier Part Number 1: RC0805FR-0710KL
R5-R7 R13 R23-R25 = RC0805FR-0722RL: 125mW Thick Film Resistors 150V ±100ppm/℃ ±1% 22Ω 0805 Chip Resistor - Surface Mount ROHS; Manufacturer: Yageo Group; Temperature Coefficient: 100ppm/°C; Supplier 1: Avnet; Manufacturer Part Number: RC0805FR-0722RL; RoHS: Compliant; Category: Chip SMD Resistors; Stock 1: 890000; Pricing 1: 5000=0.00231, 10000=0.00225, 20000=0.0022, 30000=0.00216, 40000=0.0021 (USD); Case/Package: 0805; Case Code (Imperial): 0805; China RoHS: Non-Compliant; Composition: Thick Film; Depth: 1.25mm; Features: Moisture Resistant; Height: 500µm; Lead Free: Lead Free; Length: 2.0066mm; Lifecycle Status: Production; Max Operating Temperature: 155°C; Max Power Dissipation: 125mW; Military Standard: Not; Min Operating Temperature: -55°C; Mount: Surface Mount; Number of Pins: 2; Number of Terminals: 2; Number of Terminations: 2; Packaging: Tape & Reel; Power Dissipation: 125mW; Power Rating: 125mW; REACH SVHC: Yes; Resistance: 22Ω; Schedule B: 8533210045, 8533210045|8533210045, 8533210045|8533210045|8533210045, 8533210045|8533210045|8533210045|8533210045; Termination: SMD/SMT; Tolerance: 1%; Voltage Rating: 150V; Voltage Rating (AC): 150V; Voltage Rating (DC): 150V; Width: 1.25mm; Working Voltage: 150V; ComponentLink1URL: https://datasheet.octopart.com:443/RC0805FR-0722RL-Yageo-datasheet-175887523.pdf?src-supplier=IHS; ComponentLink1Description: https://datasheet.octopart.com:443/RC0805FR-0722RL-Yageo-datasheet-175887523.pdf?src-supplier=IHS; ComponentLink2URL: https://datasheet.octopart.com:443/RC0805FR-0722RL-Yageo-datasheet-103092701.pdf?src-supplier=Upverter; ComponentLink2Description: https://datasheet.octopart.com:443/RC0805FR-0722RL-Yageo-datasheet-103092701.pdf?src-supplier=Upverter; ComponentLink3URL: https://datasheet.octopart.com:443/RC0805FR-0722RL-Yageo-datasheet-79472498.pdf?src-supplier=Upverter; ComponentLink3Description: https://datasheet.octopart.com:443/RC0805FR-0722RL-Yageo-datasheet-79472498.pdf?src-supplier=Upverter; ComponentLink4URL: https://datasheet.octopart.com:443/RC0805FR-0722RL-Yageo-datasheet-8330313.pdf?src-supplier=element14+APAC; ComponentLink4Description: https://datasheet.octopart.com:443/RC0805FR-0722RL-Yageo-datasheet-8330313.pdf?src-supplier=element14+APAC; ComponentLink5URL: https://datasheet.octopart.com:443/RC0805FR-0722RL-Yageo-datasheet-62067350.pdf?src-supplier=element14+APAC; ComponentLink5Description: https://datasheet.octopart.com:443/RC0805FR-0722RL-Yageo-datasheet-62067350.pdf?src-supplier=element14+APAC; ComponentLink6URL: https://datasheet.octopart.com:443/RC0805FR-0722RL-Yageo-datasheet-164759695.pdf?src-supplier=Future+Electronics; ComponentLink6Description: https://datasheet.octopart.com:443/RC0805FR-0722RL-Yageo-datasheet-164759695.pdf?src-supplier=Future+Electronics; ComponentLink7URL: https://datasheet.octopart.com:443/RC0805FR-0722RL-Yageo-datasheet-12592811.pdf?src-supplier=Future+Electronics; ComponentLink7Description: https://datasheet.octopart.com:443/RC0805FR-0722RL-Yageo-datasheet-12592811.pdf?src-supplier=Future+Electronics; ComponentLink8URL: https://datasheet.octopart.com:443/RC0805FR-0722RL-Yageo-datasheet-8324252.pdf?src-supplier=Future+Electronics; ComponentLink8Description: https://datasheet.octopart.com:443/RC0805FR-0722RL-Yageo-datasheet-8324252.pdf?src-supplier=Future+Electronics; ComponentLink9URL: https://datasheet.octopart.com/RC0805FR-0722RL-Yageo-datasheet-73766026.pdf; ComponentLink9Description: https://datasheet.octopart.com/RC0805FR-0722RL-Yageo-datasheet-73766026.pdf; ComponentLink10URL: https://datasheet.octopart.com:443/RC0805FR-0722RL-Yageo-datasheet-13691069.pdf?src-supplier=Farnell; ComponentLink10Description: https://datasheet.octopart.com:443/RC0805FR-0722RL-Yageo-datasheet-13691069.pdf?src-supplier=Farnell; ComponentLink11URL: https://datasheet.octopart.com:443/RC0805FR-0722RL-Yageo-datasheet-118657.pdf?src-supplier=DigiKey; ComponentLink11Description: https://datasheet.octopart.com:443/RC0805FR-0722RL-Yageo-datasheet-118657.pdf?src-supplier=DigiKey; ComponentLink12URL: http://sigma.octopart.com:80/conflict_mineral_statement/Yageo-company-3.pdf?src-supplier=Compliance+Statements; ComponentLink12Description: http://sigma.octopart.com:80/conflict_mineral_statement/Yageo-company-3.pdf?src-supplier=Compliance+Statements; ComponentLink13URL: http://sigma.octopart.com:80/rohs_statement/Yageo-company-2.pdf?src-supplier=Compliance+Statements; ComponentLink13Description: http://sigma.octopart.com:80/rohs_statement/Yageo-company-2.pdf?src-supplier=Compliance+Statements; Supplier Part Number 1: RC0805FR-0722RL
R8 R26-R28 = RC0805JR-070RL: GENERAL PURPOSE CHIP RESISTOR Metal Glaze/thick Film, 0.125W, 0ohm, Surface Mount, 0805; Manufacturer: Yageo Group; Power Dissipation: 125mW; Resistance: 0Ω; Temperature Coefficient: 300ppm/°C; Tolerance: 5%; Voltage Rating: 150V; Supplier 1: Avnet; Manufacturer Part Number: RC0805JR-070RL; RoHS: Compliant; Category: Chip SMD Resistors; Stock 1: 280000; Pricing 1: 5000=0.0025, 10000=0.00243, 20000=0.00237, 30000=0.00233, 40000=0.00227 (USD); Case/Package: 0805; Case Code (Imperial): 0805; China RoHS: Non-Compliant; Composition: Thick Film; Contact Plating: Tin; Depth: 1.25mm; Height: 500µm; Lead Free: Lead Free; Length: 2mm; Lifecycle Status: Production; Max Operating Temperature: 155°C; Military Standard: Not; Min Operating Temperature: -55°C; Mount: Surface Mount; Number of Pins: 2; Number of Terminals: 2; Packaging: Tape & Reel; Power Rating: 125mW; Radiation Hardening: No; REACH SVHC: Yes; Schedule B: 8533290000, 8533290000|8533290000, 8533290000|8533290000|8533290000, 8533290000|8533290000|8533290000|8533290000; Termination: SMD/SMT; Voltage Rating (DC): 150V; Width: 1.25mm; ComponentLink1URL: https://datasheet.octopart.com:443/RC0805JR-070RL-Yageo-datasheet-182189538.pdf?src-supplier=IHS; ComponentLink1Description: https://datasheet.octopart.com:443/RC0805JR-070RL-Yageo-datasheet-182189538.pdf?src-supplier=IHS; ComponentLink2URL: https://datasheet.octopart.com:443/RC0805JR-070RL-Yageo-datasheet-103092701.pdf?src-supplier=Upverter; ComponentLink2Description: https://datasheet.octopart.com:443/RC0805JR-070RL-Yageo-datasheet-103092701.pdf?src-supplier=Upverter; ComponentLink3URL: https://datasheet.octopart.com:443/RC0805JR-070RL-Yageo-datasheet-98239111.pdf?src-supplier=Upverter; ComponentLink3Description: https://datasheet.octopart.com:443/RC0805JR-070RL-Yageo-datasheet-98239111.pdf?src-supplier=Upverter; ComponentLink4URL: https://datasheet.octopart.com:443/RC0805JR-070RL-Yageo-datasheet-8330313.pdf?src-supplier=Newark; ComponentLink4Description: https://datasheet.octopart.com:443/RC0805JR-070RL-Yageo-datasheet-8330313.pdf?src-supplier=Newark; ComponentLink5URL: https://datasheet.octopart.com:443/RC0805JR-070RL-Yageo-datasheet-8327506.pdf?src-supplier=Newark; ComponentLink5Description: https://datasheet.octopart.com:443/RC0805JR-070RL-Yageo-datasheet-8327506.pdf?src-supplier=Newark; ComponentLink6URL: https://datasheet.octopart.com:443/RC0805JR-070RL-Yageo-datasheet-62067350.pdf?src-supplier=element14+APAC; ComponentLink6Description: https://datasheet.octopart.com:443/RC0805JR-070RL-Yageo-datasheet-62067350.pdf?src-supplier=element14+APAC; ComponentLink7URL: https://datasheet.octopart.com:443/RC0805JR-070RL-Yageo-datasheet-17879891.pdf?src-supplier=element14+APAC; ComponentLink7Description: https://datasheet.octopart.com:443/RC0805JR-070RL-Yageo-datasheet-17879891.pdf?src-supplier=element14+APAC; ComponentLink8URL: https://datasheet.octopart.com:443/RC0805JR-070RL-Yageo-datasheet-164759695.pdf?src-supplier=Future+Electronics; ComponentLink8Description: https://datasheet.octopart.com:443/RC0805JR-070RL-Yageo-datasheet-164759695.pdf?src-supplier=Future+Electronics; ComponentLink9URL: https://datasheet.octopart.com:443/RC0805JR-070RL-Yageo-datasheet-15800360.pdf?src-supplier=Future+Electronics; ComponentLink9Description: https://datasheet.octopart.com:443/RC0805JR-070RL-Yageo-datasheet-15800360.pdf?src-supplier=Future+Electronics; ComponentLink10URL: https://datasheet.octopart.com:443/RC0805JR-070RL-Yageo-datasheet-12592811.pdf?src-supplier=Future+Electronics; ComponentLink10Description: https://datasheet.octopart.com:443/RC0805JR-070RL-Yageo-datasheet-12592811.pdf?src-supplier=Future+Electronics; ComponentLink11URL: https://datasheet.octopart.com:443/RC0805JR-070RL-Yageo-datasheet-8324252.pdf?src-supplier=Future+Electronics; ComponentLink11Description: https://datasheet.octopart.com:443/RC0805JR-070RL-Yageo-datasheet-8324252.pdf?src-supplier=Future+Electronics; ComponentLink12URL: https://datasheet.octopart.com:443/RC0805JR-070RL-Yageo-datasheet-79472498.pdf?src-supplier=Megastar; ComponentLink12Description: https://datasheet.octopart.com:443/RC0805JR-070RL-Yageo-datasheet-79472498.pdf?src-supplier=Megastar; ComponentLink13URL: https://datasheet.octopart.com/RC0805JR-070RL-Yageo-datasheet-73766026.pdf; ComponentLink13Description: https://datasheet.octopart.com/RC0805JR-070RL-Yageo-datasheet-73766026.pdf; ComponentLink14URL: https://datasheet.octopart.com:443/RC0805JR-070RL-Yageo-datasheet-8377918.pdf?src-supplier=Farnell; ComponentLink14Description: https://datasheet.octopart.com:443/RC0805JR-070RL-Yageo-datasheet-8377918.pdf?src-supplier=Farnell; ComponentLink15URL: https://datasheet.octopart.com:443/RC0805JR-070RL-Yageo-datasheet-118657.pdf?src-supplier=DigiKey; ComponentLink15Description: https://datasheet.octopart.com:443/RC0805JR-070RL-Yageo-datasheet-118657.pdf?src-supplier=DigiKey; ComponentLink16URL: http://sigma.octopart.com:80/rohs_statement/Yageo-company-2.pdf?src-supplier=Compliance+Statements; ComponentLink16Description: http://sigma.octopart.com:80/rohs_statement/Yageo-company-2.pdf?src-supplier=Compliance+Statements; ComponentLink17URL: http://sigma.octopart.com:80/conflict_mineral_statement/Yageo-company-3.pdf?src-supplier=Compliance+Statements; ComponentLink17Description: http://sigma.octopart.com:80/conflict_mineral_statement/Yageo-company-3.pdf?src-supplier=Compliance+Statements; Supplier Part Number 1: RC0805JR-070RL